# EAGLE schematic Flight-Mill-Controller (EAGLE 9.6.2)

## Sheet 1 of 5
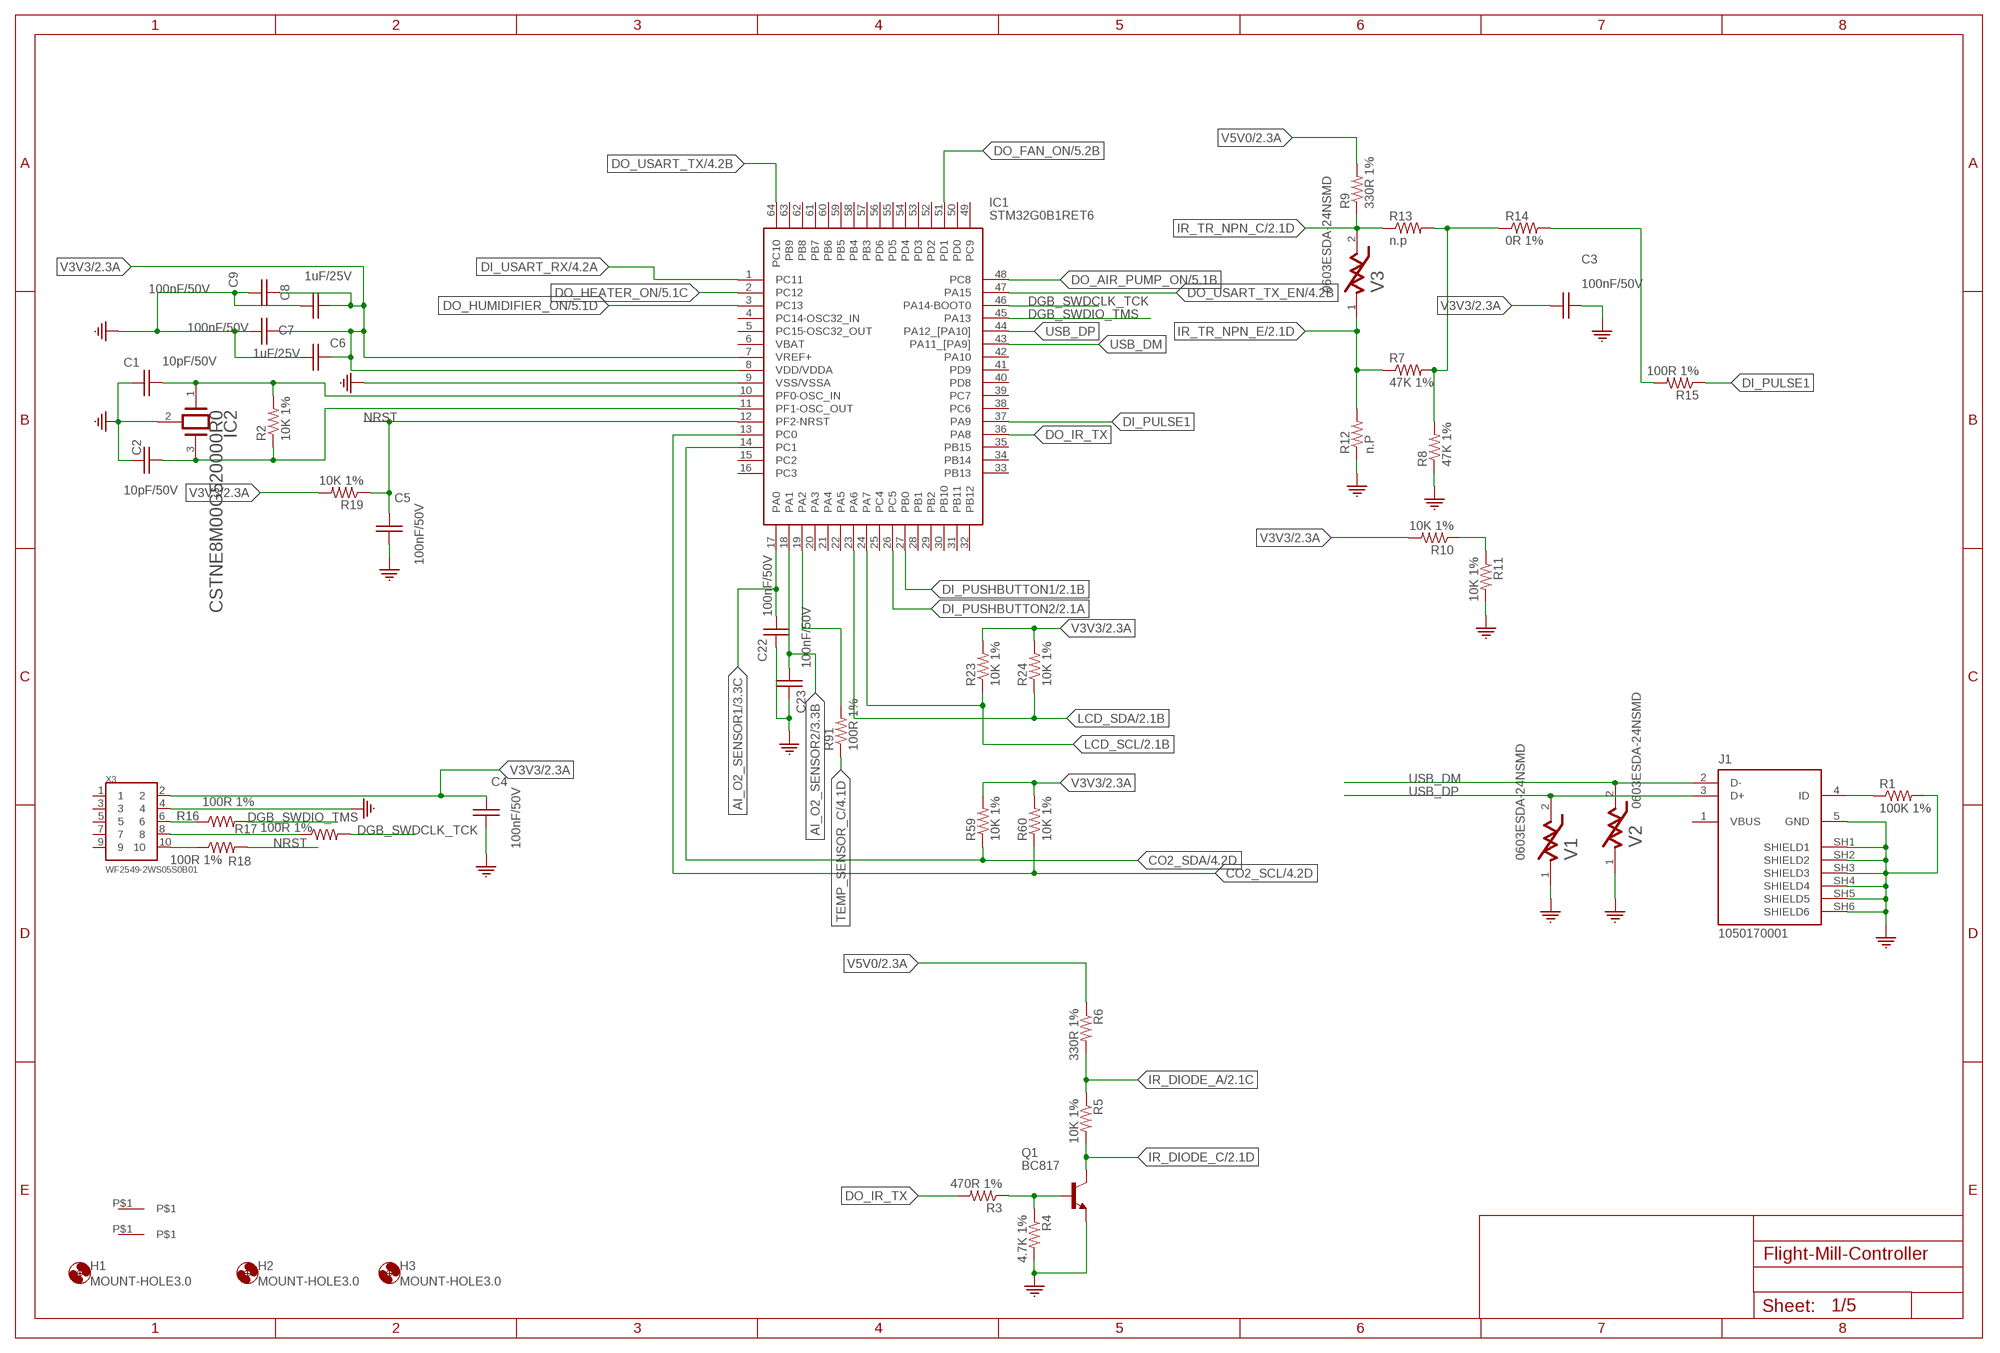
[diagram p0: schematic, sheet 1]

### Parts
C1  10pF/50V  C_0603EIA0603  [EIA0603]
C2  10pF/50V  C_0603EIA0603  [EIA0603]
C3  100nF/50V  C_0603EIA0603  [EIA0603]
C4  100nF/50V  C_0603EIA0603  [EIA0603]
C5  100nF/50V  C_0603EIA0603  [EIA0603]
C6  1uF/25V  C_0603EIA0603  [EIA0603]
C7  100nF/50V  C_0603EIA0603  [EIA0603]
C8  1uF/25V  C_0603EIA0603  [EIA0603]
C9  100nF/50V  C_0603EIA0603  [EIA0603]
C22  100nF/50V  C_0603EIA0603  [EIA0603]
C23  100nF/50V  C_0603EIA0603  [EIA0603]
FID1  FIDUCIAL  [FIDUCIAL]
FID2  FIDUCIAL  [FIDUCIAL]
H1  MOUNT-HOLE3.0  [3,0]
H2  MOUNT-HOLE3.0  [3,0]
H3  MOUNT-HOLE3.0  [3,0]
IC1  STM32G0B1RET6  [QFP50P1200X1200X160-64N]
IC2  CSTNE8M00G520000R0  [CSTNE8M00G520000R0]
J1  1050170001  [MOLEX_1050170001]
Q1  BC817  [SOT23]
R1  100K 1%  R_0603  [EIA0603]
R2  10K 1%  R_0603  [EIA0603]
R3  470R 1%  R_0603  [EIA0603]
R4  4.7K 1%  R_0603  [EIA0603]
R5  10K 1%  R_0603  [EIA0603]
R6  330R 1%  R_0603  [EIA0603]
R7  47K 1%  R_0603  [EIA0603]
R8  47K 1%  R_0603  [EIA0603]
R9  330R 1%  R_0603  [EIA0603]
R10  10K 1%  R_0603  [EIA0603]
R11  10K 1%  R_0603  [EIA0603]
R12  n.P  R_0603  [EIA0603]
R13  n.p  R_0603  [EIA0603]
R14  0R 1%  R_0603  [EIA0603]
R15  100R 1%  R_0603  [EIA0603]
R16  100R 1%  R_0603  [EIA0603]
R17  100R 1%  R_0603  [EIA0603]
R18  100R 1%  R_0603  [EIA0603]
R19  10K 1%  R_0603  [EIA0603]
R23  10K 1%  R_0603  [EIA0603]
R24  10K 1%  R_0603  [EIA0603]
R59  10K 1%  R_0603  [EIA0603]
R60  10K 1%  R_0603  [EIA0603]
R91  100R 1%  R_0603  [EIA0603]
V1  0603ESDA-24NSMD  [EIA0603]
V2  0603ESDA-24NSMD  [EIA0603]
V3  0603ESDA-24NSMD  [EIA0603]
X3  WF2549-2WS05S0B01  [X10_100MIL_2XROW_VERT]

### Nets
AI_O2_SENSOR1: C22.2 IC1.17(PA0) ; also sheet 3
AI_O2_SENSOR2: C23.2 IC1.18(PA1) ; also sheet 3
CO2_SCL: IC1.13(PC0) R60.1 ; also sheet 4
CO2_SDA: IC1.14(PC1) R59.1 ; also sheet 4
DGB_SWDCLK_TCK: IC1.46(PA14-BOOT0) R17.2
DGB_SWDIO_TMS: IC1.45(PA13) R16.2
DI_PULSE1: IC1.37(PA9) R15.1
DI_PUSHBUTTON1: IC1.27(PB0) ; also sheet 2
DI_PUSHBUTTON2: IC1.26(PC5) ; also sheet 2
DI_USART_RX: IC1.1(PC11) ; also sheet 4
DO_AIR_PUMP_ON [LV]: IC1.48(PC8) ; also sheet 5
DO_FAN_ON: IC1.51(PD1) ; also sheet 5
DO_HEATER_ON: IC1.2(PC12) ; also sheet 5
DO_HUMIDIFIER_ON: IC1.3(PC13) ; also sheet 5
DO_IR_TX: IC1.36(PA8) R3.2
DO_USART_TX: IC1.64(PC10) ; also sheet 4
DO_USART_TX_EN: IC1.47(PA15) ; also sheet 4
GND [LV]: C1.1 C2.1 C3.2 C4.1 C5.1 C6.2 C7.2 C8.2 C9.2 C22.1 C23.1 IC1.9(VSS/VSSA) IC2.2(GND) J1.5(GND) J1.SH1(SHIELD1) J1.SH2(SHIELD2) J1.SH3(SHIELD3) J1.SH4(SHIELD4) J1.SH5(SHIELD5) J1.SH6(SHIELD6) Q1.2(E) R1.2 R4.2 R8.1 R11.2 R12.1 V1.1 V2.1 X3.4 ; also sheet 2,3,4,5
IR_DIODE_A: R5.1 R6.2 ; also sheet 2
IR_DIODE_C: Q1.3(C) R5.2 ; also sheet 2
IR_TR_NPN_C: R9.1 R13.1 V3.2 ; also sheet 2
IR_TR_NPN_E: R7.1 R12.2 V3.1 ; also sheet 2
LCD_SCL: IC1.24(PA7) R23.1 ; also sheet 2
LCD_SDA: IC1.23(PA6) R24.1 ; also sheet 2
N$1: R16.1 X3.6
N$3: C1.2 IC1.10(PF0-OSC_IN) IC2.1(INPUT) R2.2
N$4: J1.4(ID) R1.1
N$5: C2.2 IC1.11(PF1-OSC_OUT) IC2.3(OUTPUT) R2.1
N$6: R7.2 R8.2 R13.2 R14.1
N$7: Q1.1(B) R3.1 R4.1
N$8: R10.1 R11.1
N$10: R14.2 R15.2
N$11: R17.1 X3.8
N$13: R18.1 X3.10
N$55: IC1.19(PA2) R91.2
NRST: C5.2 IC1.12(PF2-NRST) R18.2 R19.1
TEMP_SENSOR_C: R91.1 ; also sheet 4
USB_DM: IC1.43(PA11_[PA9]) J1.2(D-) V2.2
USB_DP: IC1.44(PA12_[PA10]) J1.3(D+) V1.2
V3V3: C3.1 C4.2 C6.1 C7.1 C8.1 C9.1 IC1.7(VREF+) IC1.8(VDD/VDDA) R10.2 R19.2 R23.2 R24.2 R59.2 R60.2 X3.2 ; also sheet 2,4
V5V0: R6.1 R9.2 ; also sheet 2,3,4
Unconnected: FID1.P$1 FID2.P$1 IC1.4(PC14-OSC32_IN) IC1.5(PC15-OSC32_OUT) IC1.6(VBAT) IC1.15(PC2) IC1.16(PC3) IC1.20(PA3) IC1.21(PA4) IC1.22(PA5) IC1.25(PC4) IC1.28(PB1) IC1.29(PB2) IC1.30(PB10) IC1.31(PB11) IC1.32(PB12) IC1.33(PB13) IC1.34(PB14) IC1.35(PB15) IC1.38(PC6) IC1.39(PC7) IC1.40(PD8) IC1.41(PD9) IC1.42(PA10) IC1.49(PC9) IC1.50(PD0) IC1.52(PD2) IC1.53(PD3) IC1.54(PD4) IC1.55(PD5) IC1.56(PD6) IC1.57(PB3) IC1.58(PB4) IC1.59(PB5) IC1.60(PB6) IC1.61(PB7) IC1.62(PB8) IC1.63(PB9) X3.1 X3.3 X3.5 X3.7 X3.9

## Sheet 2 of 5
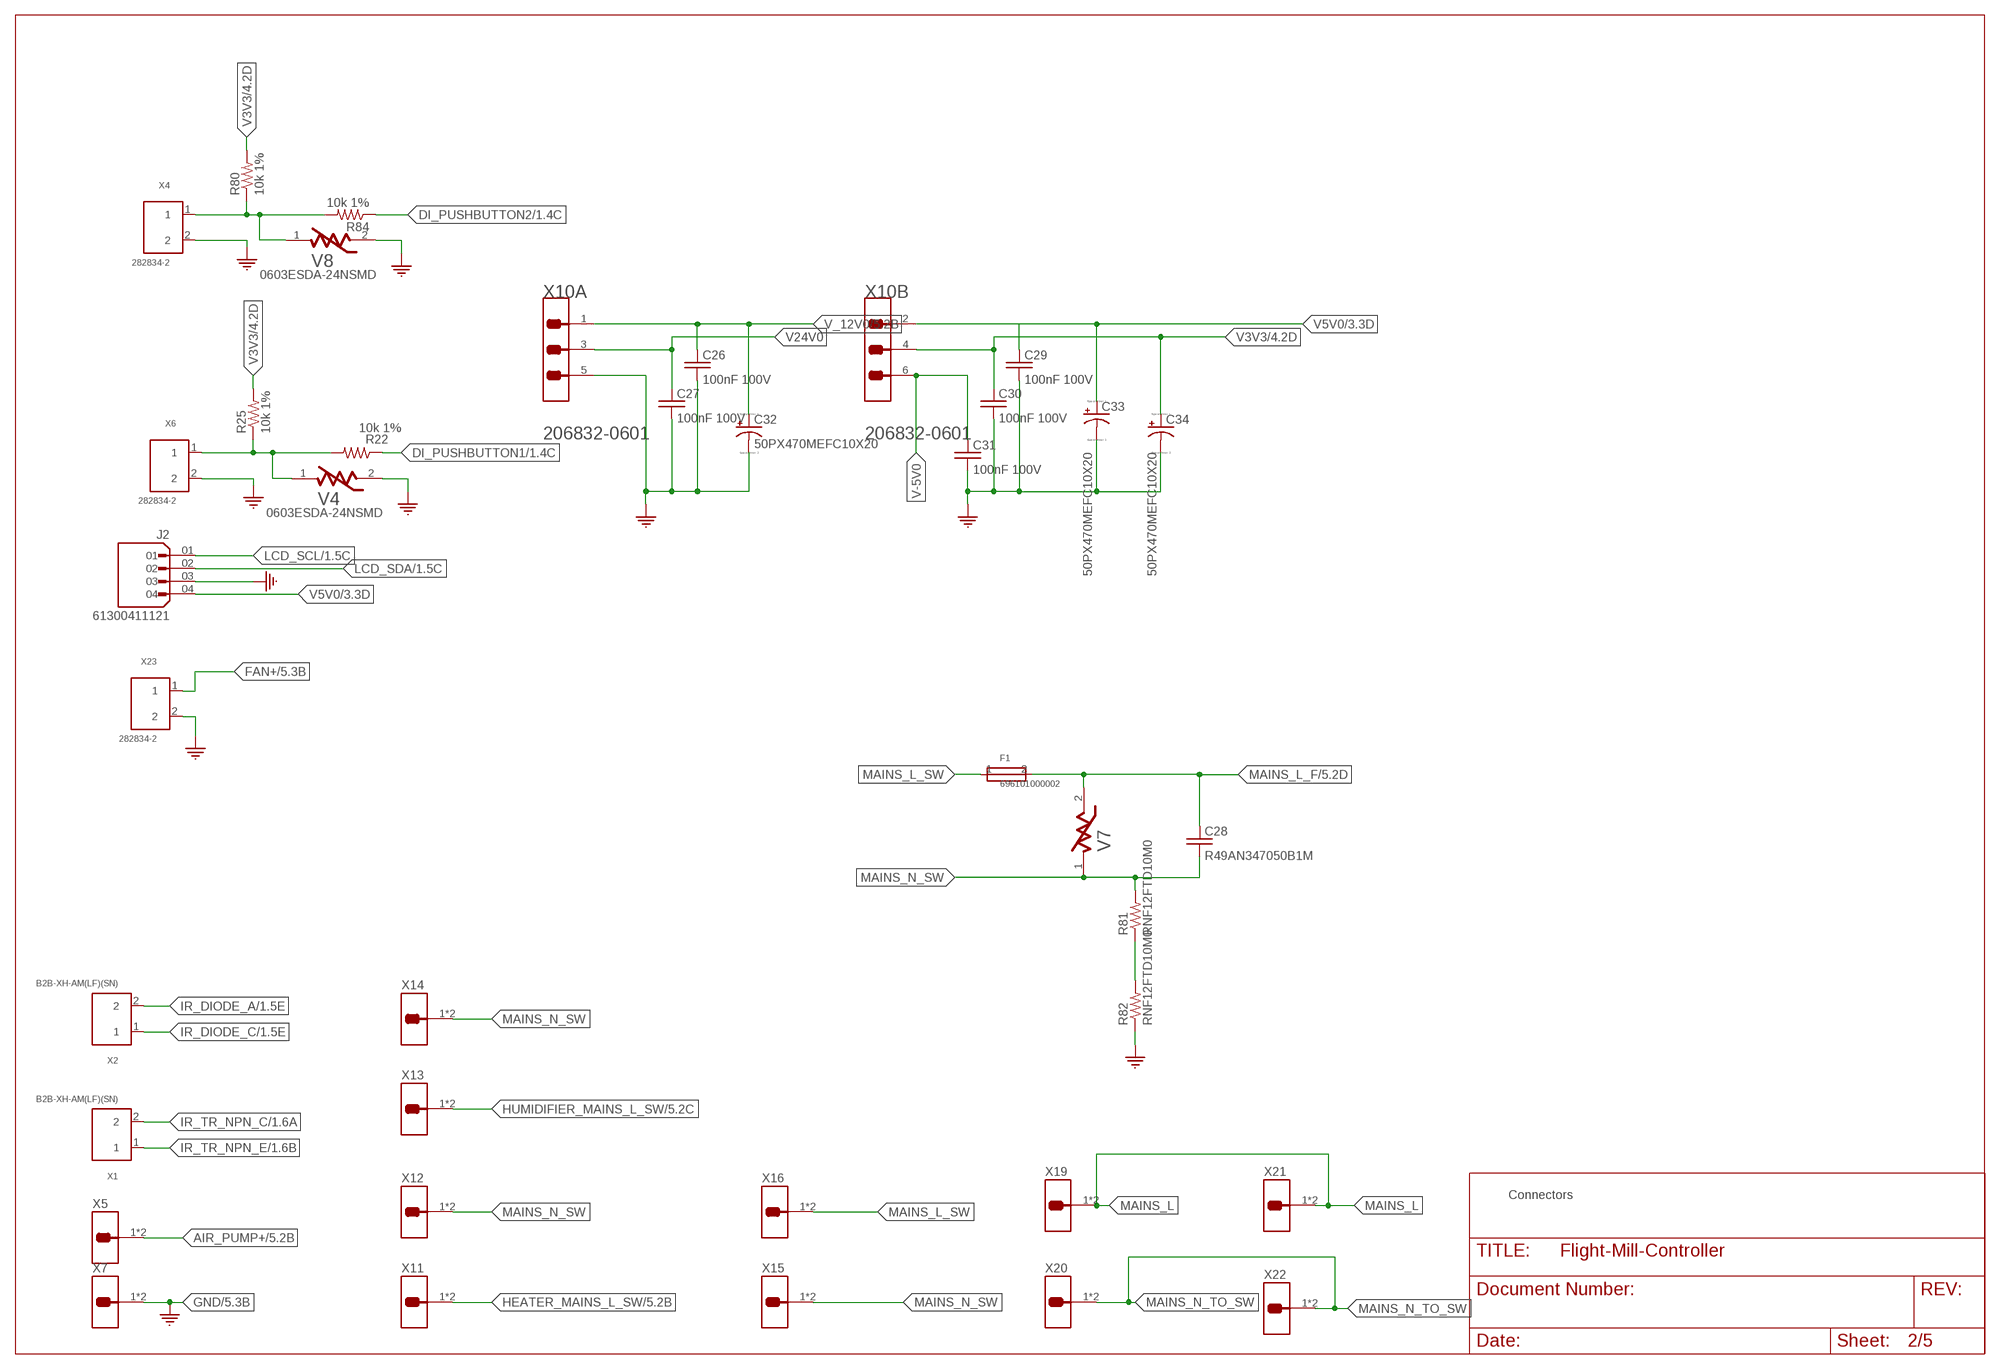
[diagram p1: schematic, sheet 2]
FRAME2 (DINA3_L): SHEETNAME: Connectors

### Parts
C26  100nF 100V  C_0603EIA0603  [EIA0603]
C27  100nF 100V  C_0603EIA0603  [EIA0603]
C28  R49AN347050B1M  [R49AN347050B1M]
C29  100nF 100V  C_0603EIA0603  [EIA0603]
C30  100nF 100V  C_0603EIA0603  [EIA0603]
C31  100nF 100V  C_0603EIA0603  [EIA0603]
C32  50PX470MEFC10X20  [CAPACITOR-ELKO-RM5-10X16]
C33  50PX470MEFC10X20  [CAPACITOR-ELKO-RM5-10X16]
C34  50PX470MEFC10X20  [CAPACITOR-ELKO-RM5-10X16]
F1  696101000002  [FUSE_RM22.6]
J2  61300411121  [X04_100MIL_1ROW]
R22  10k 1%  R_0603  [EIA0603]
R25  10k 1%  R_0603  [EIA0603]
R80  10k 1%  R_0603  [EIA0603]
R81  RNF12FTD10M0  [RES-RM12.5-VR37]
R82  RNF12FTD10M0  [RES-RM12.5-VR37]
R84  10k 1%  R_0603  [EIA0603]
V4  0603ESDA-24NSMD  [EIA0603]
V7  B72205S0271K101B72205S2131K101  [EPCOS_B72205S0271K101_0]
V8  0603ESDA-24NSMD  [EIA0603]
X1  B2B-XH-AM(LF)(SN)  [B2B-XH-AM(LF)(SN)]
X2  B2B-XH-AM(LF)(SN)  [B2B-XH-AM(LF)(SN)]
X4  282834-2  [TE_282834-2_0]
X5  726386-2TE_726386-2  [TE_726386-2]
X6  282834-2  [TE_282834-2_0]
X7  726386-2TE_726386-2  [TE_726386-2]
X10  MOLEX_206832-0601MOLEX_206832-0601  [MOLEX_206832-0601]
X11  726386-2TE_726386-2  [TE_726386-2]
X12  726386-2TE_726386-2  [TE_726386-2]
X13  726386-2TE_726386-2  [TE_726386-2]
X14  726386-2TE_726386-2  [TE_726386-2]
X15  726386-2TE_726386-2  [TE_726386-2]
X16  726386-2TE_726386-2  [TE_726386-2]
X19  726386-2TE_726386-2  [TE_726386-2]
X20  726386-2TE_726386-2  [TE_726386-2]
X21  726386-2TE_726386-2  [TE_726386-2]
X22  726386-2TE_726386-2  [TE_726386-2]
X23  282834-2  [TE_282834-2_0]

### Nets
AIR_PUMP+ [LV]: X5.1 X5.1-2 ; also sheet 5
DI_PUSHBUTTON1: R22.1 ; also sheet 1
DI_PUSHBUTTON2: R84.1 ; also sheet 1
FAN+: X23.1 ; also sheet 5
GND [LV]: C26.2 C27.2 C29.2 C30.2 C31.2 C32.2(-) C33.2(-) C34.2(-) J2.03 R82.1 V4.2 V8.2 X4.2 X6.2 X7.1 X7.1-2 X10.5 X23.2 ; also sheet 1,3,4,5
HEATER_MAINS_L_SW [Mains_L]: X11.1 X11.1-2 ; also sheet 5
HUMIDIFIER_MAINS_L_SW [Mains_L]: X13.1 X13.1-2 ; also sheet 5
IR_DIODE_A: X2.2 ; also sheet 1
IR_DIODE_C: X2.1 ; also sheet 1
IR_TR_NPN_C: X1.2 ; also sheet 1
IR_TR_NPN_E: X1.1 ; also sheet 1
LCD_SCL: J2.01 ; also sheet 1
LCD_SDA: J2.02 ; also sheet 1
MAINS_L [Mains_L]: X19.1 X19.1-2 X21.1 X21.1-2
MAINS_L_F [Mains_L]: C28.1 F1.2 V7.2 ; also sheet 5
MAINS_L_SW [Mains_L]: F1.1 X16.1 X16.1-2
MAINS_N_SW [Mains_N]: C28.2 R81.2 V7.1 X12.1 X12.1-2 X14.1 X14.1-2 X15.1 X15.1-2
MAINS_N_TO_SW [Mains_N]: X20.1 X20.1-2 X22.1 X22.1-2
N$47: R81.1 R82.2
N$50: R22.2 R25.1 V4.1 X6.1
N$51: R80.1 R84.2 V8.1 X4.1
V3V3: C30.1 C34.1(+) R25.2 R80.2 X10.4 ; also sheet 1,4
V5V0: C29.1 C33.1(+) J2.04 X10.2 ; also sheet 1,3,4
V24V0: C27.1 X10.3
V-5V0: C31.1 X10.6
V_12V0 [LV]: C26.1 C32.1(+) X10.1 ; also sheet 5

## Sheet 3 of 5
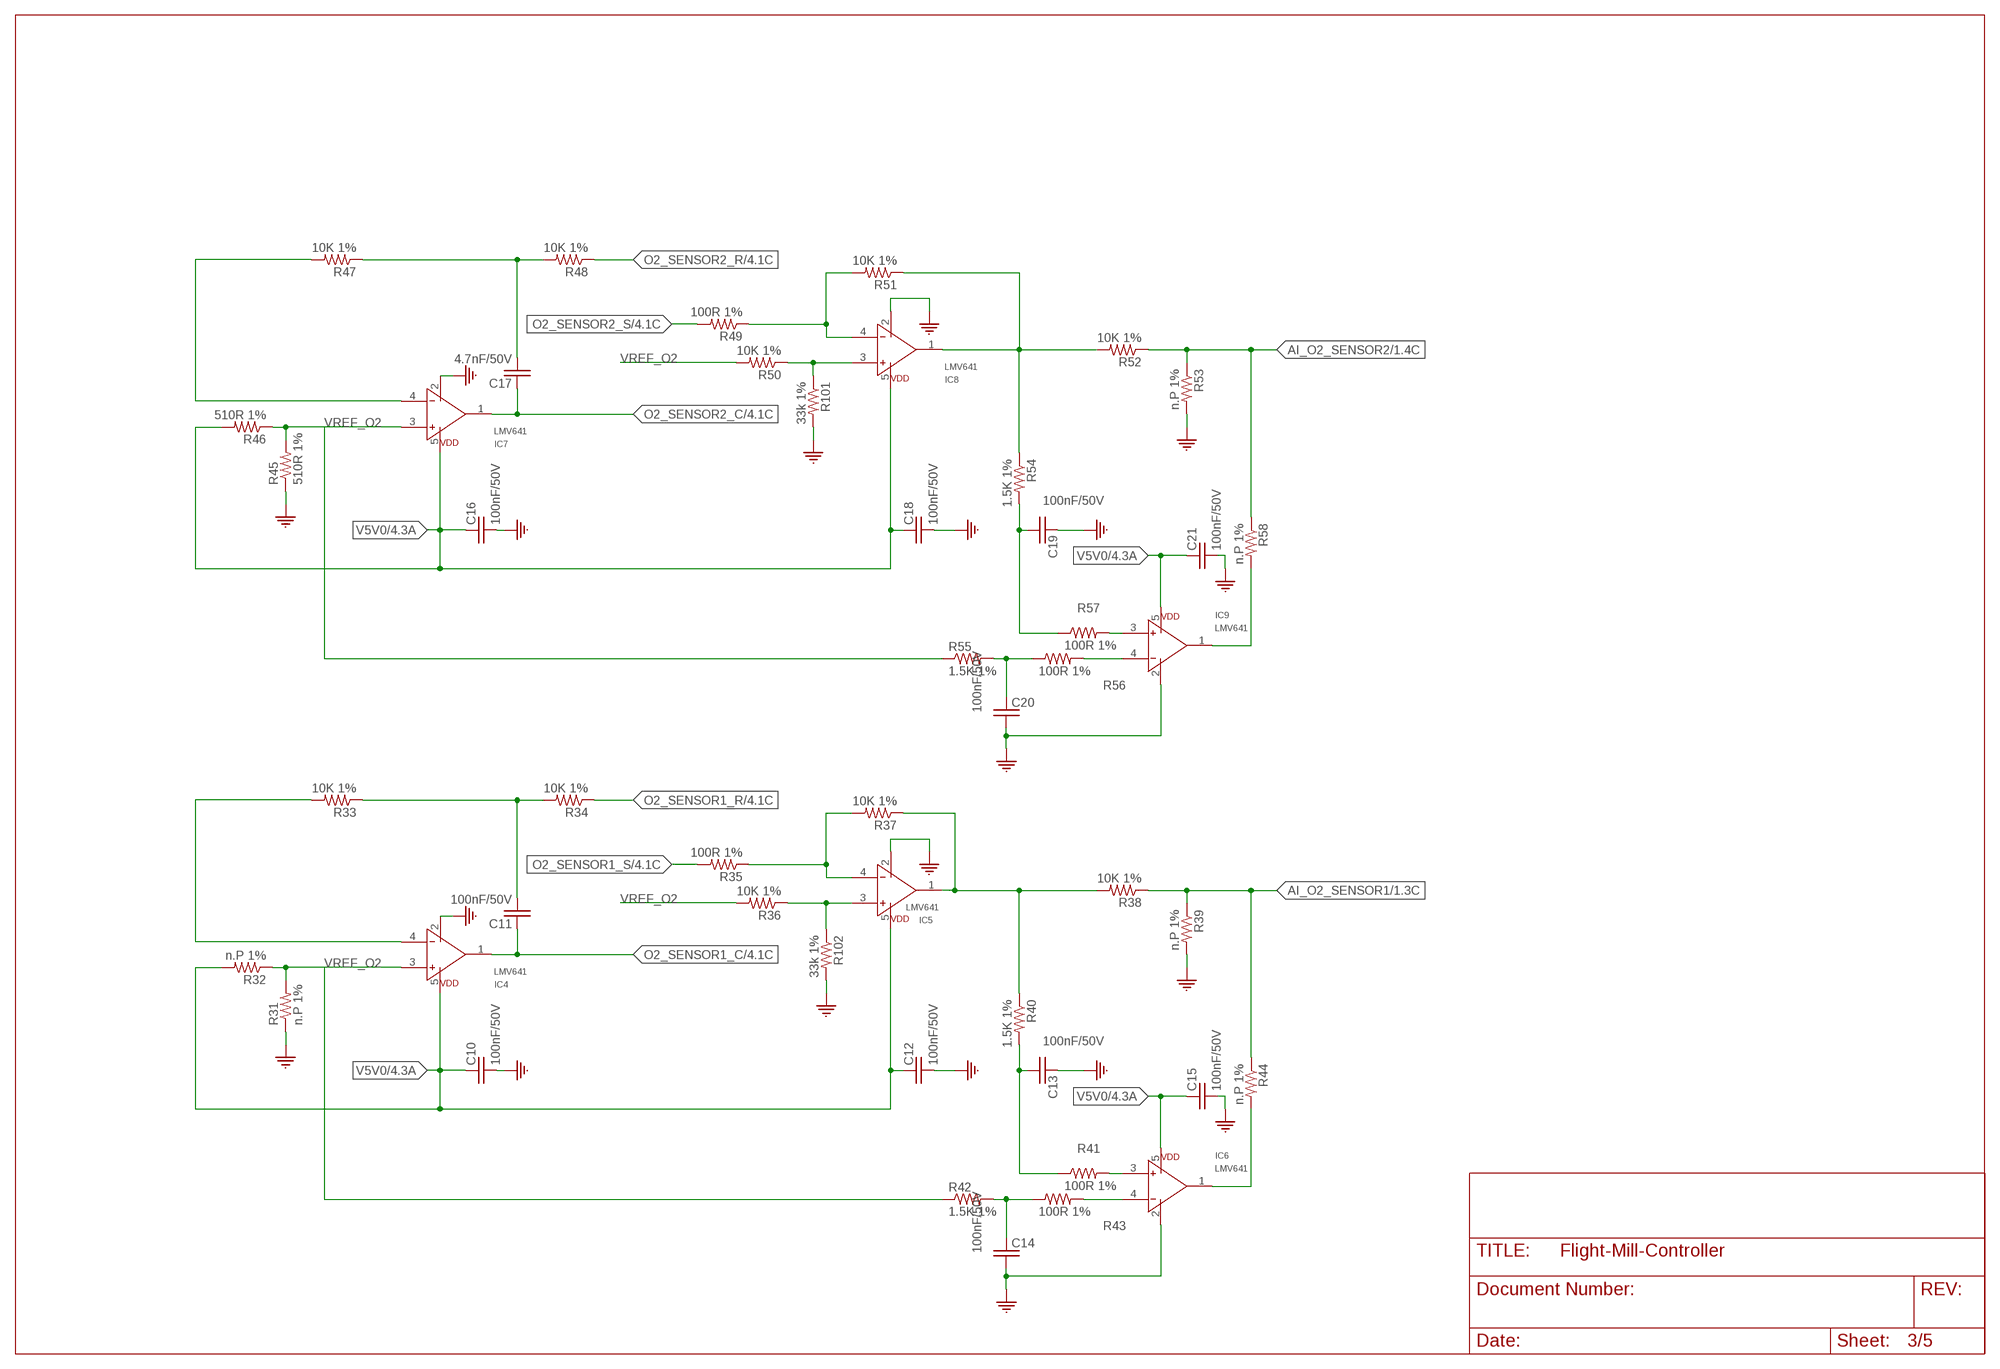
[diagram p2: schematic, sheet 3]

### Parts
C10  100nF/50V  C_0603EIA0603  [EIA0603]
C11  100nF/50V  C_0603EIA0603  [EIA0603]
C12  100nF/50V  C_0603EIA0603  [EIA0603]
C13  100nF/50V  C_0603EIA0603  [EIA0603]
C14  100nF/50V  C_0603EIA0603  [EIA0603]
C15  100nF/50V  C_0603EIA0603  [EIA0603]
C16  100nF/50V  C_0603EIA0603  [EIA0603]
C17  4.7nF/50V  C_0603EIA0603  [EIA0603]
C18  100nF/50V  C_0603EIA0603  [EIA0603]
C19  100nF/50V  C_0603EIA0603  [EIA0603]
C20  100nF/50V  C_0603EIA0603  [EIA0603]
C21  100nF/50V  C_0603EIA0603  [EIA0603]
IC4  LMV641  [SOT-23-5]
IC5  LMV641  [SOT-23-5]
IC6  LMV641  [SOT-23-5]
IC7  LMV641  [SOT-23-5]
IC8  LMV641  [SOT-23-5]
IC9  LMV641  [SOT-23-5]
R31  n.P 1%  R_0603  [EIA0603]
R32  n.P 1%  R_0603  [EIA0603]
R33  10K 1%  R_0603  [EIA0603]
R34  10K 1%  R_0603  [EIA0603]
R35  100R 1%  R_0603  [EIA0603]
R36  10K 1%  R_0603  [EIA0603]
R37  10K 1%  R_0603  [EIA0603]
R38  10K 1%  R_0603  [EIA0603]
R39  n.P 1%  R_0603  [EIA0603]
R40  1.5K 1%  R_0603  [EIA0603]
R41  100R 1%  R_0603  [EIA0603]
R42  1.5K 1%  R_0603  [EIA0603]
R43  100R 1%  R_0603  [EIA0603]
R44  n.P 1%  R_0603  [EIA0603]
R45  510R 1%  R_0603  [EIA0603]
R46  510R 1%  R_0603  [EIA0603]
R47  10K 1%  R_0603  [EIA0603]
R48  10K 1%  R_0603  [EIA0603]
R49  100R 1%  R_0603  [EIA0603]
R50  10K 1%  R_0603  [EIA0603]
R51  10K 1%  R_0603  [EIA0603]
R52  10K 1%  R_0603  [EIA0603]
R53  n.P 1%  R_0603  [EIA0603]
R54  1.5K 1%  R_0603  [EIA0603]
R55  1.5K 1%  R_0603  [EIA0603]
R56  100R 1%  R_0603  [EIA0603]
R57  100R 1%  R_0603  [EIA0603]
R58  n.P 1%  R_0603  [EIA0603]
R101  33k 1%  R_0603  [EIA0603]
R102  33k 1%  R_0603  [EIA0603]

### Nets
AI_O2_SENSOR: IC5.1(OUT) R37.1 R38.2 R40.1
AI_O2_SENSOR1: R38.1 R39.1 R44.1 ; also sheet 1
AI_O2_SENSOR2: R52.1 R53.1 R58.1 ; also sheet 1
GND [LV]: C10.2 C12.2 C13.1 C14.2 C15.2 C16.2 C18.2 C19.1 C20.2 C21.2 IC4.2(VEE) IC5.2(VEE) IC6.2(VEE) IC7.2(VEE) IC8.2(VEE) IC9.2(VEE) R31.1 R39.2 R45.1 R53.2 R101.2 R102.2 ; also sheet 1,2,4,5
N$14: IC5.4(IN-) R35.1 R37.2
N$15: C13.2 R40.2 R41.1
N$16: C11.2 R33.1 R34.2
N$17: IC4.4(IN-) R33.2
N$18: IC6.3(IN+) R41.2
N$19: IC5.3(IN+) R36.1 R102.1
N$20: IC6.4(IN-) R43.2
N$21: C14.1 R42.2 R43.1
N$22: IC6.1(OUT) R44.2
N$23: C17.2 R47.1 R48.2
N$24: IC7.4(IN-) R47.2
N$25: IC8.4(IN-) R49.1 R51.2
N$26: IC8.3(IN+) R50.1 R101.1
N$27: C19.2 R54.2 R57.1
N$28: IC9.3(IN+) R57.2
N$29: IC9.4(IN-) R56.2
N$30: C20.1 R55.2 R56.1
N$31: IC9.1(OUT) R58.2
N$32: IC8.1(OUT) R51.1 R52.2 R54.1
O2_SENSOR1_C: C11.1 IC4.1(OUT) ; also sheet 4
O2_SENSOR1_R: R34.1 ; also sheet 4
O2_SENSOR1_S: R35.2 ; also sheet 4
O2_SENSOR2_C: C17.1 IC7.1(OUT) ; also sheet 4
O2_SENSOR2_R: R48.1 ; also sheet 4
O2_SENSOR2_S: R49.2 ; also sheet 4
V5V0: C10.1 C12.1 C15.1 C16.1 C18.1 C21.1 IC4.5(VCC) IC5.5(VCC) IC6.5(VCC) IC7.5(VCC) IC8.5(VCC) IC9.5(VCC) R32.2 R46.2 ; also sheet 1,2,4
VREF_O2: IC4.3(IN+) IC7.3(IN+) R31.2 R32.1 R36.2 R42.1 R45.2 R46.1 R50.2 R55.1

## Sheet 4 of 5
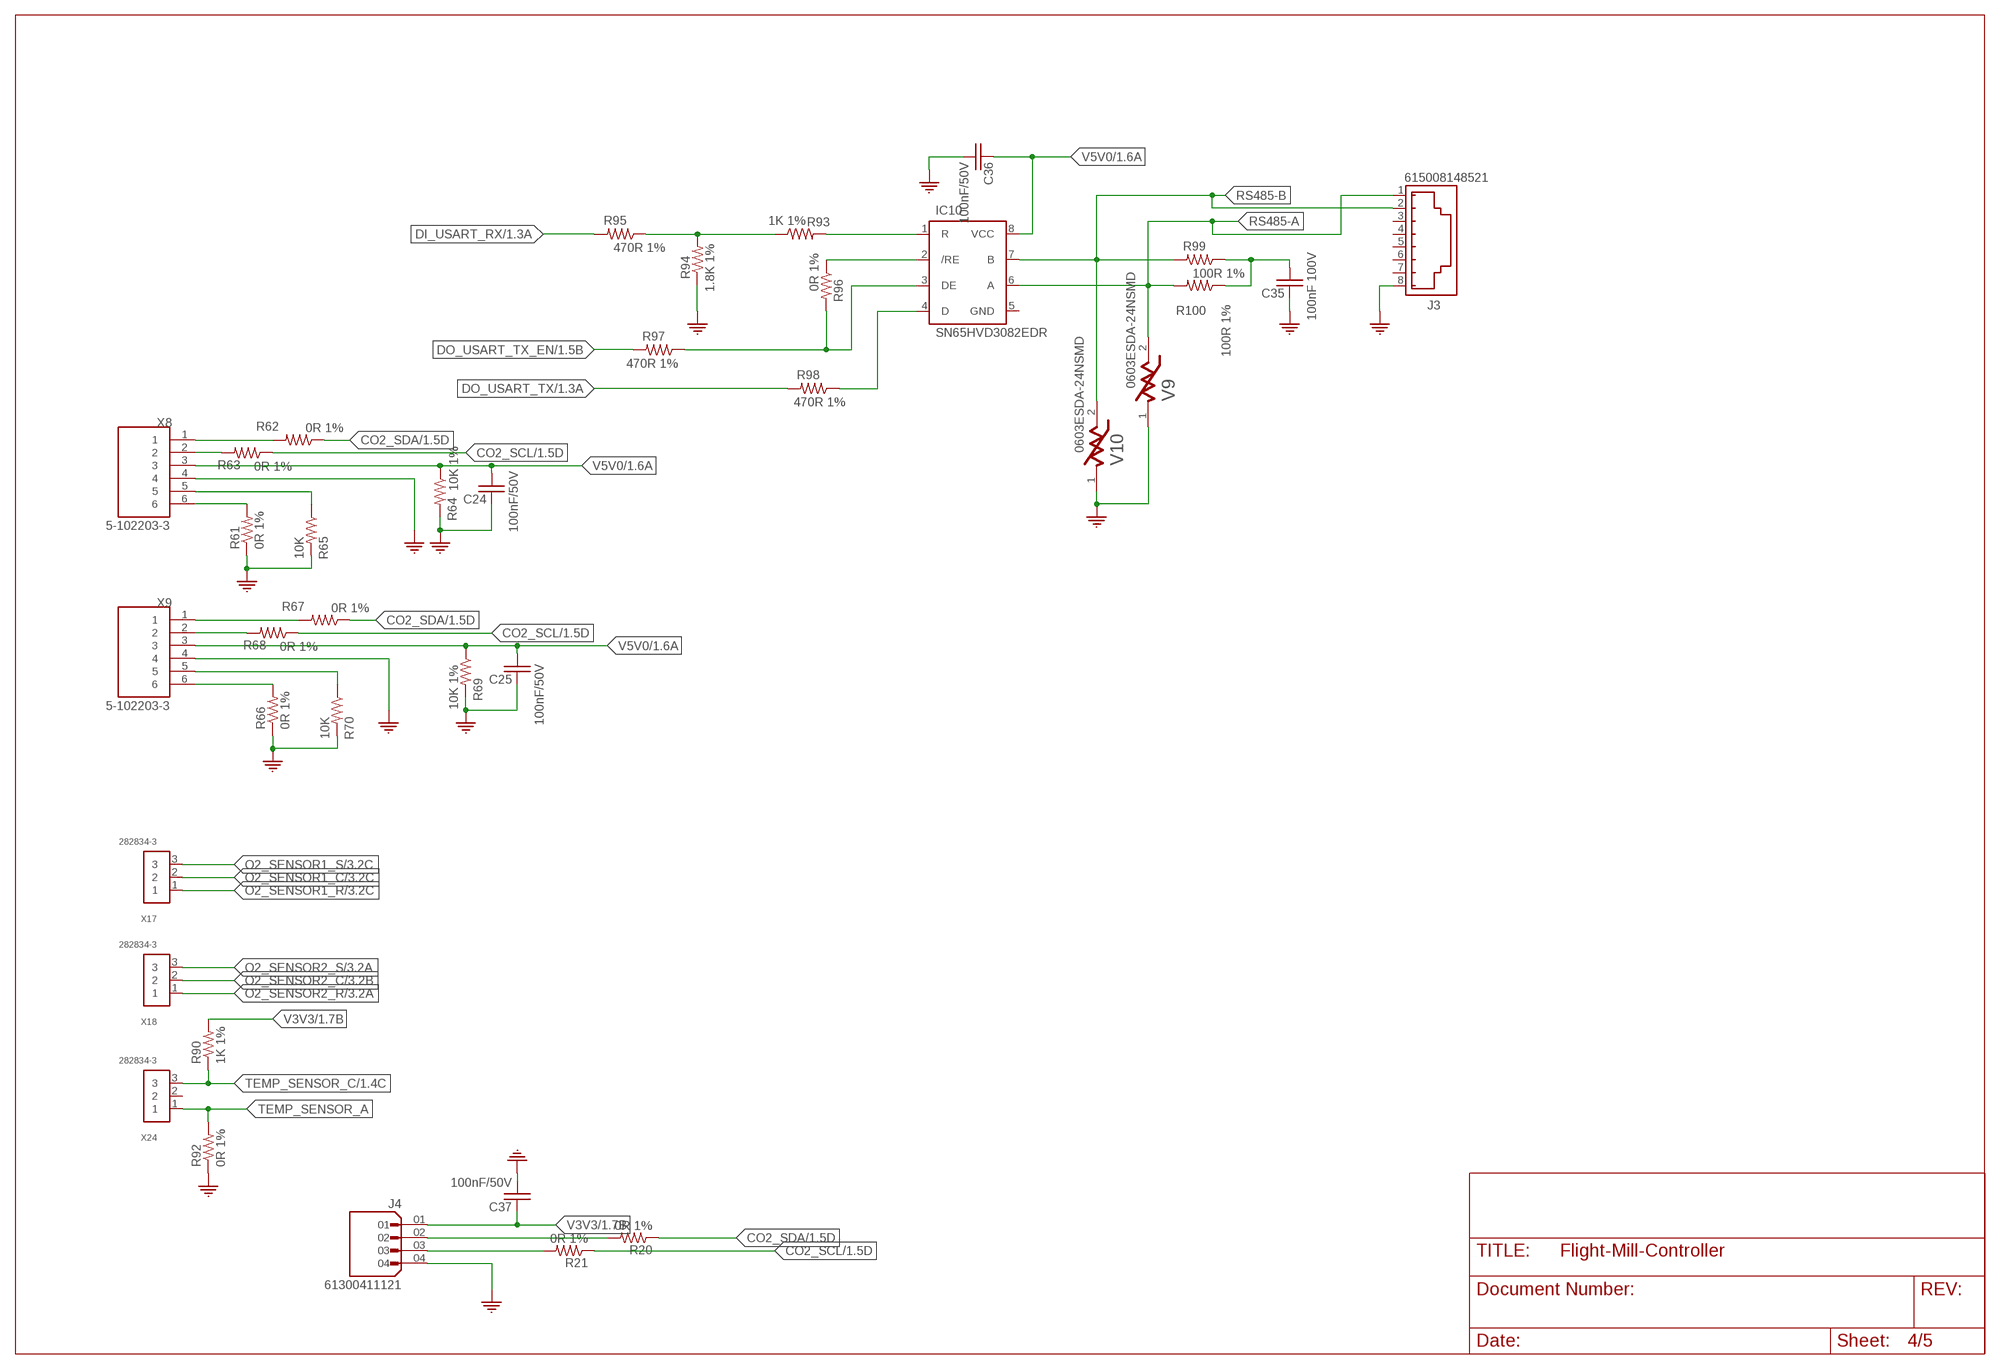
[diagram p3: schematic, sheet 4]

### Parts
C24  100nF/50V  C_0603EIA0603  [EIA0603]
C25  100nF/50V  C_0603EIA0603  [EIA0603]
C35  100nF 100V  C_0603EIA0603  [EIA0603]
C36  100nF/50V  C_0603EIA0603  [EIA0603]
C37  100nF/50V  C_0603EIA0603  [EIA0603]
IC10  SN65HVD3082EDR  [SOIC8]
J3  615008148521  [615008148521]
J4  61300411121  [X04_100MIL_1ROW]
R20  0R 1%  R_0603  [EIA0603]
R21  0R 1%  R_0603  [EIA0603]
R61  0R 1%  R_0603  [EIA0603]
R62  0R 1%  R_0603  [EIA0603]
R63  0R 1%  R_0603  [EIA0603]
R64  10K 1%  R_0603  [EIA0603]
R65  10K  R_0603  [EIA0603]
R66  0R 1%  R_0603  [EIA0603]
R67  0R 1%  R_0603  [EIA0603]
R68  0R 1%  R_0603  [EIA0603]
R69  10K 1%  R_0603  [EIA0603]
R70  10K  R_0603  [EIA0603]
R90  1K 1%  R_0603  [EIA0603]
R92  0R 1%  R_0603  [EIA0603]
R93  1K 1%  R_0603  [EIA0603]
R94  1.8K 1%  R_0603  [EIA0603]
R95  470R 1%  R_0603  [EIA0603]
R96  0R 1%  R_0603  [EIA0603]
R97  470R 1%  R_0603  [EIA0603]
R98  470R 1%  R_0603  [EIA0603]
R99  100R 1%  R_0603  [EIA0603]
R100  100R 1%  R_0603  [EIA0603]
V9  0603ESDA-24NSMD  [EIA0603]
V10  0603ESDA-24NSMD  [EIA0603]
X8  5-102203-3  [TE_5-102203-3]
X9  5-102203-3  [TE_5-102203-3]
X17  282834-3  [TE_282834-3_0]
X18  282834-3  [TE_282834-3_0]
X24  282834-3  [TE_282834-3_0]

### Nets
CO2_SCL: R21.1 R63.1 R68.1 ; also sheet 1
CO2_SDA: R20.1 R62.1 R67.1 ; also sheet 1
DI_USART_RX: R95.2 ; also sheet 1
DO_USART_TX: R98.2 ; also sheet 1
DO_USART_TX_EN: R97.2 ; also sheet 1
GND [LV]: C24.1 C25.1 C35.1 C36.2 C37.2 J3.8 J4.04 R61.1 R64.2 R65.2 R66.1 R69.2 R70.2 R92.1 R94.1 V9.1 V10.1 X8.4 X9.4 ; also sheet 1,2,3,5
N$33: R61.2 X8.6
N$34: R62.2 X8.1
N$35: R63.2 X8.2
N$36: R65.1 X8.5
N$37: R66.2 X9.6
N$38: R67.2 X9.1
N$39: R68.2 X9.2
N$40: R70.1 X9.5
N$56: R93.1 R94.2 R95.1
N$57: IC10.1(R) R93.2
N$59: IC10.2(/RE) R96.1
N$60: IC10.3(DE) R96.2 R97.1
N$61: IC10.4(D) R98.1
N$62: J4.02 R20.2
N$63: J4.03 R21.2
N$64: C35.2 R99.1 R100.1
O2_SENSOR1_C: X17.2 ; also sheet 3
O2_SENSOR1_R: X17.1 ; also sheet 3
O2_SENSOR1_S: X17.3 ; also sheet 3
O2_SENSOR2_C: X18.2 ; also sheet 3
O2_SENSOR2_R: X18.1 ; also sheet 3
O2_SENSOR2_S: X18.3 ; also sheet 3
RS485-A: IC10.6(A) J3.1 R100.2 V9.2
RS485-B: IC10.7(B) J3.2 R99.2 V10.2
TEMP_SENSOR_A: R92.2 X24.1
TEMP_SENSOR_C: R90.1 X24.3 ; also sheet 1
V3V3: C37.1 J4.01 R90.2 ; also sheet 1,2
V5V0: C24.2 C25.2 C36.1 IC10.8(VCC) R64.1 R69.1 X8.3 X9.3 ; also sheet 1,2,3
Unconnected: IC10.5(GND) J3.3 J3.4 J3.5 J3.6 J3.7 X24.2

## Sheet 5 of 5
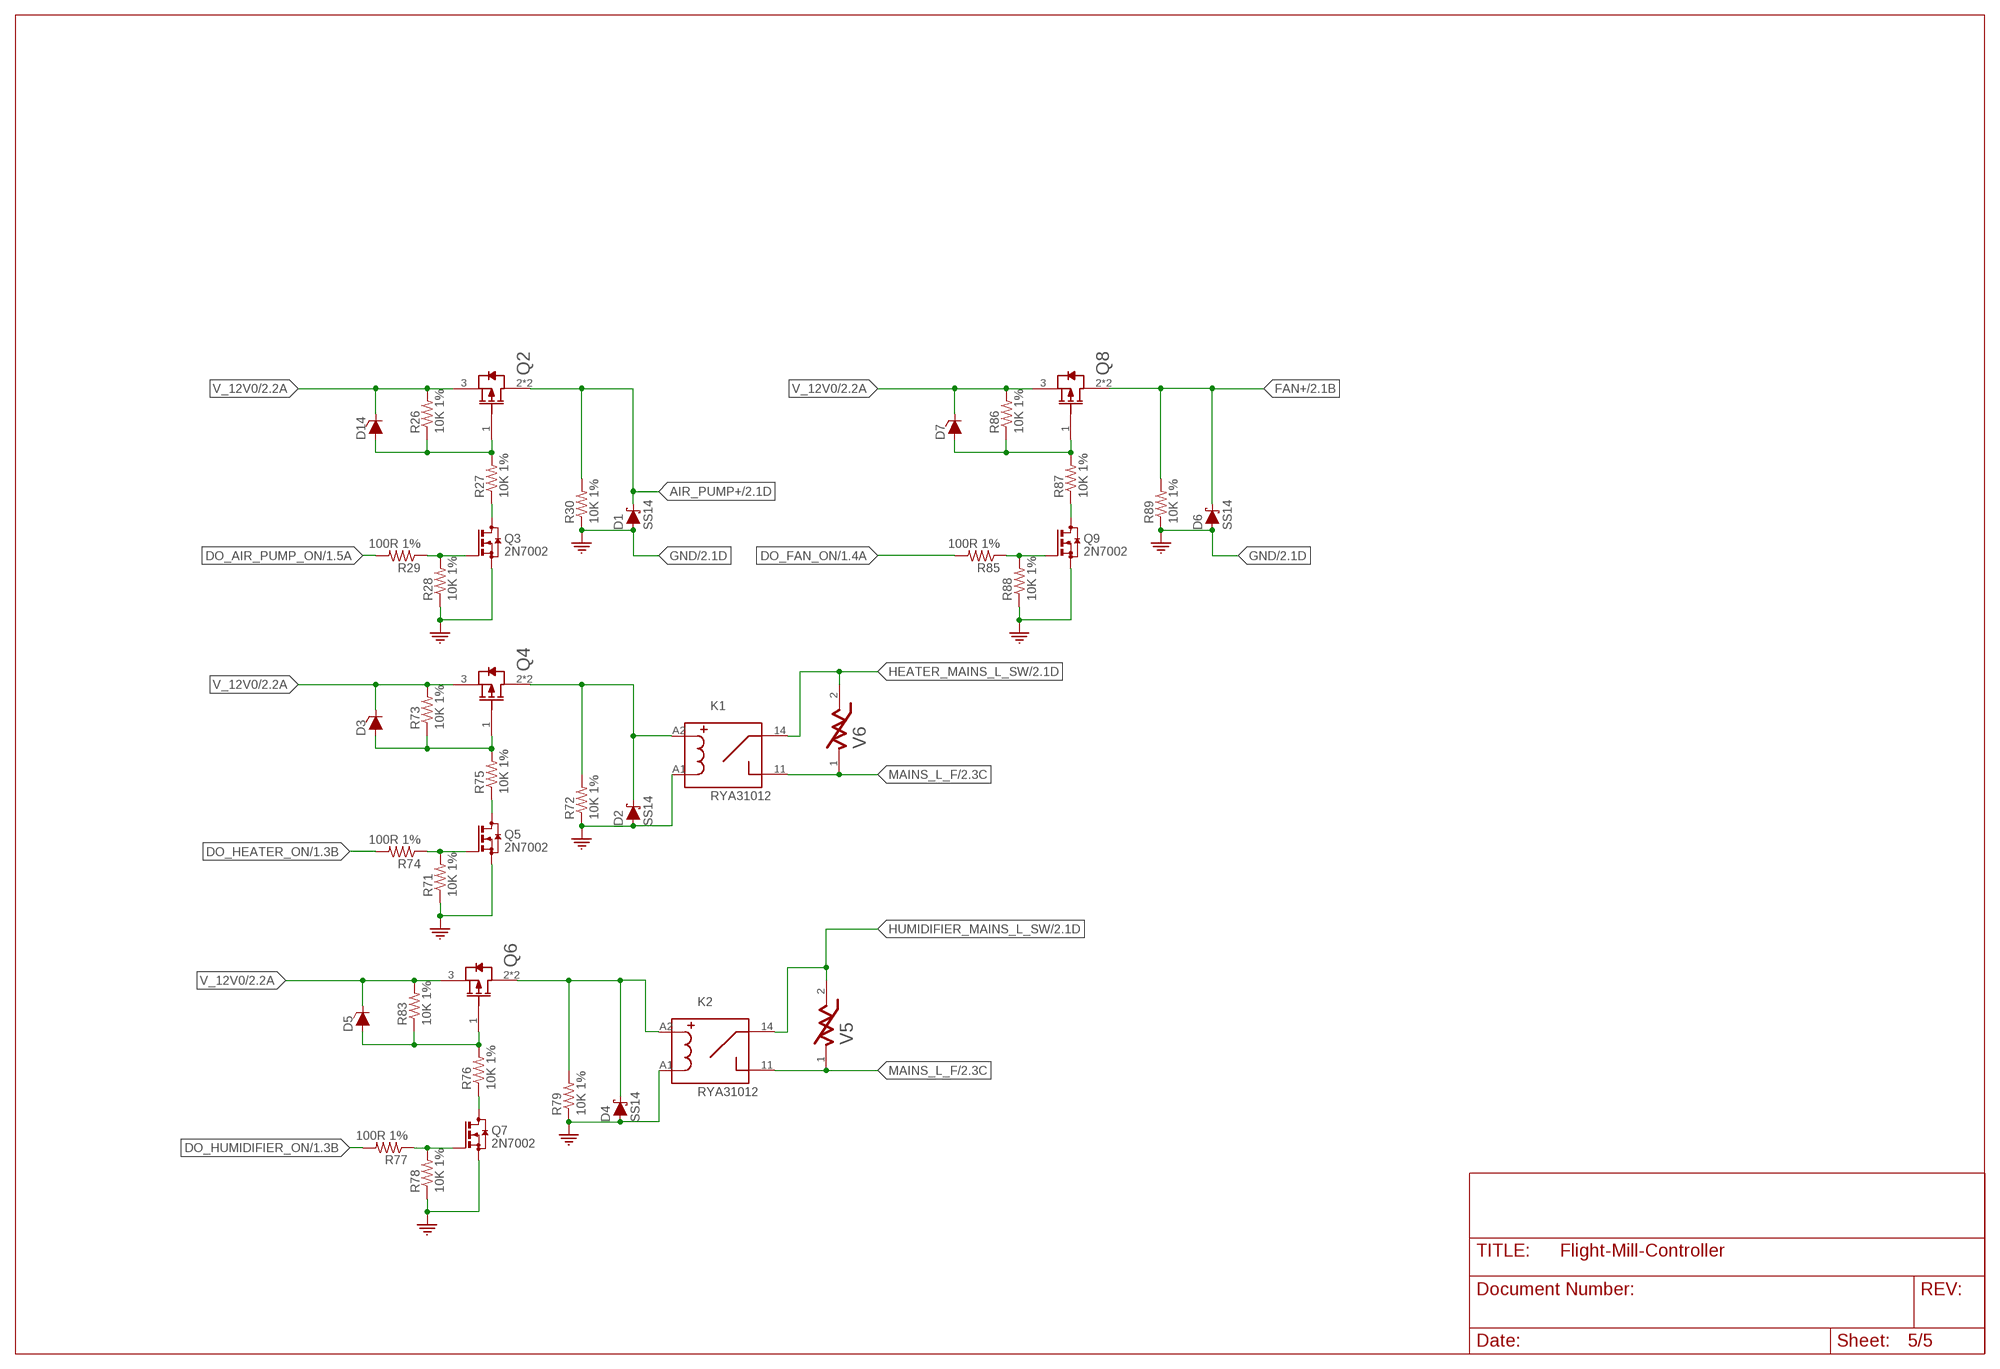
[diagram p4: schematic, sheet 5]

### Parts
D1  SS14  [SMA]
D2  SS14  [SMA]
D3  MMBZ4696-HE3-18  [SOT23-3]
D4  SS14  [SMA]
D5  MMBZ4696-HE3-18  [SOT23-3]
D6  SS14  [SMA]
D7  MMBZ4696-HE3-18  [SOT23-3]
D14  MMBZ4696-HE3-18  [SOT23-3]
K1  RYA31012  [RYA31012]
K2  RYA31012  [RYA31012]
Q2  UT2955G-AA3-R  [SOT223]
Q3  2N7002  [SOT23]
Q4  UT2955G-AA3-R  [SOT223]
Q5  2N7002  [SOT23]
Q6  UT2955G-AA3-R  [SOT223]
Q7  2N7002  [SOT23]
Q8  UT2955G-AA3-R  [SOT223]
Q9  2N7002  [SOT23]
R26  10K 1%  R_0603  [EIA0603]
R27  10K 1%  R_0603  [EIA0603]
R28  10K 1%  R_0603  [EIA0603]
R29  100R 1%  R_0603  [EIA0603]
R30  10K 1%  R_0603  [EIA0603]
R71  10K 1%  R_0603  [EIA0603]
R72  10K 1%  R_0603  [EIA0603]
R73  10K 1%  R_0603  [EIA0603]
R74  100R 1%  R_0603  [EIA0603]
R75  10K 1%  R_0603  [EIA0603]
R76  10K 1%  R_0603  [EIA0603]
R77  100R 1%  R_0603  [EIA0603]
R78  10K 1%  R_0603  [EIA0603]
R79  10K 1%  R_0603  [EIA0603]
R83  10K 1%  R_0603  [EIA0603]
R85  100R 1%  R_0603  [EIA0603]
R86  10K 1%  R_0603  [EIA0603]
R87  10K 1%  R_0603  [EIA0603]
R88  10K 1%  R_0603  [EIA0603]
R89  10K 1%  R_0603  [EIA0603]
V5  B72205S0271K101B72205S2131K101  [EPCOS_B72205S0271K101_0]
V6  B72205S0271K101B72205S2131K101  [EPCOS_B72205S0271K101_0]

### Nets
AIR_PUMP+ [LV]: D1.1(C) Q2.2(DRAIN) Q2.4(DRAIN) R30.2 ; also sheet 2
DO_AIR_PUMP_ON [LV]: R29.2 ; also sheet 1
DO_FAN_ON: R85.2 ; also sheet 1
DO_HEATER_ON: R74.2 ; also sheet 1
DO_HUMIDIFIER_ON: R77.2 ; also sheet 1
FAN+: D6.1(C) Q8.2(DRAIN) Q8.4(DRAIN) R89.2 ; also sheet 2
GND [LV]: D1.2(A) D2.2(A) D4.2(A) D6.2(A) K1.A1 K2.A1 Q3.2(S) Q5.2(S) Q7.2(S) Q9.2(S) R28.1 R30.1 R71.1 R72.1 R78.1 R79.1 R88.1 R89.1 ; also sheet 1,2,3,4
HEATER_MAINS_L_SW [Mains_L]: K1.14 V6.2 ; also sheet 2
HUMIDIFIER_MAINS_L_SW [Mains_L]: K2.14 V5.2 ; also sheet 2
MAINS_L_F [Mains_L]: K1.11 K2.11 V5.1 V6.1 ; also sheet 2
N$2 [LV]: D14.1(A) Q2.1(GATE) R26.1 R27.2
N$9 [LV]: Q3.3(D) R27.1
N$12 [LV]: Q3.1(G) R28.2 R29.1
N$41 [LV]: D3.1(A) Q4.1(GATE) R73.1 R75.2
N$42 [LV]: Q5.3(D) R75.1
N$43 [LV]: Q5.1(G) R71.2 R74.1
N$44 [LV]: D5.1(A) Q6.1(GATE) R76.2 R83.1
N$45 [LV]: Q7.3(D) R76.1
N$46 [LV]: Q7.1(G) R77.1 R78.2
N$48 [LV]: D4.1(C) K2.A2 Q6.2(DRAIN) Q6.4(DRAIN) R79.2
N$49 [LV]: D2.1(C) K1.A2 Q4.2(DRAIN) Q4.4(DRAIN) R72.2
N$52 [LV]: D7.1(A) Q8.1(GATE) R86.1 R87.2
N$53 [LV]: Q9.3(D) R87.1
N$54 [LV]: Q9.1(G) R85.1 R88.2
V_12V0 [LV]: D3.3(C) D5.3(C) D7.3(C) D14.3(C) Q2.3(SOURCE) Q4.3(SOURCE) Q6.3(SOURCE) Q8.3(SOURCE) R26.2 R73.2 R83.2 R86.2 ; also sheet 2

## Power pins joined to a net without a drawn wire
VBUS: J1.1(VBUS)

## Library data of the parts
C1-C27 C29-C31 C35-C37 = Labops_Lib_AH:C_0603
C28 = Labops_Lib_AH:R49AN347050B1M: 0.47µF X Cap 330V 800V Polypropylene (PP), Metallized Radial; DESCRIPTION: Film,X1,470nF/330Vac,THT; LIB_STATUS: Verified; MFN: R49AN347050B1M; MFR: Kemet; OUR_STOCK: 8; PART_VALUE: 470nF/330VAC; PRICE-1: 1.51; SUPPLIER-1: Digikey
C32-C34 = Labops_Lib_AH:50PX470MEFC10X20: Electrolytic Cap, 470µF, 25V, Low ESR, Kemet, Pitch=5mm, Dia=10mm, L=12,5mm; DESCRIPTION: 470uF ±20% 50V 10mm 20mm 5mm 2000Hrs @ 105℃ -55℃ ~ +105℃; LIB_STATUS: Prototype; MFN: 50PX470MEFC10X20; MFR: Rubicon; OUR_STOCK: 20; PART_VALUE: 470uF/50V; PRICE-1: 0.14; SUPPLIER-1: LCSC; TECHNOLOGY: THT
D1 D2 D4 D6 = Labops_Lib_AH:SS14; DESCRIPTION: Diode Schottky 1A/40V (SMA); LIB_STATUS: Prototype; MFN: SS14-LTP; MFR: MCC; OUR_STOCK: 10; PART_VALUE: Schottky 1A/40V; PRICE-1: 0.05; SUPPLIER-1: LCSC
D3 D5 D7 D14 = Labops_Lib_AH:MMBZ4696-HE3-18: Zener 9.1 Volt 0.225W 5%; DESCRIPTION: Zener Diodes 9.1 Volt 0.225W 5% AUTO; MFN: MMBZ4696-HE3-18; MFR: Vishay; OUR_STOCK: 500; PART_VALUE: 9V 5%; PRICE-1: 0.06; SUPPLIER-1: Mouser
F1 = Labops_Lib_AH:696101000002; DESCRIPTION: Fuse Block 10 A 250V 1 Circuit Cartridge Through Hole; LIB_STATUS: Prototype; MFN: 696101000002; MFR: Wurth Elektronik; OUR_STOCK: 10; PART_VALUE: 10A 5mmx20mm; PRICE-1: 0.64; SUPPLIER-1: Digikey
FID1 FID2 = Labops_Lib_AH:FIDUCIAL
H1-H3 = holes:MOUNT-HOLE: MOUNTING HOLE with drill center marker
IC1 = Labops_Lib_AH:STM32G0B1RET6: Mainstream Arm Cortex-M0+ 32-bit MCU, up to 512KB Flash, 144KB RAM, 6x USART, timers, ADC, DAC, comm. I/Fs, 1.7-3.6V Source: Datasheet <https://www.st.com/resource/en/datasheet/stm32g0b1cc.pdf>; ARROW_PART_NUMBER: STM32G0B1RET6; ARROW_PRICE-STOCK: https://www.arrow.com/en/products/stm32g0b1ret6/stmicroelectronics?region=nac; DESCRIPTION: Mainstream Arm Cortex-M0+ 32-bit MCU, up to 512KB Flash, 144KB RAM, 6x USART, timers, ADC, DAC, comm. I/Fs, 1.7-3.6V; HEIGHT: 1.6mm; MANUFACTURER_NAME: STMicroelectronics; MANUFACTURER_PART_NUMBER: STM32G0B1RET6; MOUSER_PART_NUMBER: 511-STM32G0B1RET6; MOUSER_PRICE-STOCK: https://www.mouser.co.uk/ProductDetail/STMicroelectronics/STM32G0B1RET6?qs=pUKx8fyJudDnJgtz7LZZ0A%3D%3D
IC2 = Labops_Lib_AH:CSTNE8M00G520000R0: 8.000MHz ±0.50% Ceramic Resonator with Built in Capacitor 10pF 40Ω Stability ±0.20% 3-SMD; DESCRIPTION: 8MHz ±0.5% 10pF 40Ω SMD3213-3P Ceramic Resonators; LIB_STATUS: Prototype; MFN: CSTNE8M00G520000R0; MFR: Murata; PART_VALUE: 8MHz, 0.5%; PRICE-1: 0.12; SUPPLIER-1: LCSC
IC4-IC9 = Labops_Lib_AH:LMV641: Opamp, 1MHz, SOT23-5, One Channel, Rail-Rail; DESCRIPTION: 1CH 10MHz 1 Low power 2.3 V/us 2.7V~12V SOT-23-5 OpAmp; MFN: LMV641MF/NOPB; MFR: Texas Instruments; PACKAGE: SOT23-5; PART_VALUE: LMV641
IC10 = Labops_Lib_AH:SN65HVD3082EDR; DESCRIPTION: RS485 Transciever, 200Kbps, SOIC-8 , ALT: TP8485E-SR (3Peak); LIB_STATUS: Prototype; MFN: SN65HVD3082EDR; MFR: TI,3Peak; OUR_STOCK: 10; PART_VALUE: RS485 Driver; PRICE-1: 0.30; SUPPLIER-1: LCSC
J1 = Labops_Lib_AH:1050170001: Check availability <https://pricing.snapeda.com/parts/1050170001/Molex/view-part?ref=eda>; AVAILABILITY: In Stock; CHECK_PRICES: https://www.snapeda.com/parts/1050170001/Molex/view-part/?ref=eda; DESCRIPTION: USB - micro B USB 2.0 Receptacle Connector 5 Position Surface Mount, Right Angle; Through Hole; MF: Molex; MP: 1050170001; PACKAGE: None; PRICE: None; PURCHASE-URL: https://www.snapeda.com/api/url_track_click_mouser/?unipart_id=2755530&manufacturer=Molex&part_name=1050170001&search_term=None; SNAPEDA_LINK: https://www.snapeda.com/parts/1050170001/Molex/view-part/?ref=snap
J2 J4 = Labops_Lib_AH:61300411121: Check availability <https://pricing.snapeda.com/parts/61300411121/W%C3%BCrth%20Elektronik/view-part?ref=eda> Check availability <https://pricing.snapeda.com/parts/61300411121/Wurth%20Electronics/view-part?ref=eda>; DESCRIPTION: Connector Header Through Hole 4 position 0.100 (2.54mm); MFN: 61300411121; MFR: Wurth Electronics
J3 = Labops_Lib_AH:615008148521: WR-MJ Modular Jack Horizontal Plastic 8P8C Tab Up KIND PROPERTIES Quality Class:500 Mating cycles General Information Operating Temperature:-40 up to +85 °C Compliance: RoHS Electrical Properties IR 1:1.5A Working Voltage:120V (AC) Withstanding Voltage:1000V (AC) Contact Resistance:20mΩ RISO:500 MΩ Material Properties Insulator MateriaL:PBT Insulator Flammability Rating:UL94 V-0 Color:Black Contact Material Copper Alloy Contact Plating:Gold Contact Type:Stamped Packaging Properties Packaging:Tray <https://www.we-online.com/catalog/media/o76656v209%20Family_WR-MJ_Plastic_Horizontal_Tab-UP_615008148521.jpg> Details see: https://www.we-online.com/catalog/en/MJ_HORIZONTAL_PLASTIC_8P8C_TAB_UP/ Updated by Yingchun,Shan 2020-01-06 2020 (C) Würth Elektronik; DESCRIPTION: RJ45 unshielded 8P8C; MFN: 615008148521; MFR: Wurth Elektronik; PART_VALUE: 615008148521; TYPE: Horizontal
K1 K2 = Labops_Lib_AH:RYA31012; DESCRIPTION: 5A Relay 12V, SPST NO (1Form A); MFN: RYA31012; MFR: TE Connectivity
Q1 = Labops_Lib_AH:BC817; DESCRIPTION: Transistor BJT NPN SOT23 45V 0.5A; MFN: BC817; MFR: NXP; PRICE-1: 0.03; SUPPLIER-1: Mouser
Q2 Q4 Q6 Q8 = Labops_Lib_AH:UT2955G-AA3-R: PMOSFET, SOT-223, 60V, 1.7A; DESRIPTION: PMOSFET 60V, 1.7A, SOT223; MFN: UT2955G-AA3-R; MFR: UTC; OUR_STOCK: 100; PART_VALUE: UT2955G; PRICE-1: 0.18; SUPPLIER-1: LCSC
Q3 Q5 Q7 Q9 = Labops_Lib_AH:2N7002; DESCRIPTION: NMOSFET, 500mA, 60V, Vth 2.5V; LIB_STATUS: Prototype; MFN: 2N7002; MFR: Diodes, Guangdong Hotetech,NXP; OUR_STOCK: 100; PART_VALUE: NMOSFET; PRICE-1: 0.02; SUPPLIER-1: LCSC
R1-R80 R83-R102 = Labops_Lib_AH:R_0603; MFN: Open Source 0603
R81 R82 = Labops_Lib_AH:RNF12FTD10M0; DESCRIPTION: 10 MOhms ±1% 0.5W, 1/2W Through Hole Resistor Axial Flame Retardant Coating, Safety Metal Film; LIB_STATUS: Prototype; MFN: RNF12FTD10M0; MFR: Stackpole Electronics Inc; OUR-STOCK: 20; PART_VALUE: 10Meg 5%; PRICE-1: 0.29; SUPPLIER-1: Digikey
V1-V4 V8-V10 = Labops_Lib_AH:0603ESDA-24N; DESCRIPTION: aristor 0603 SMD Bidirectional 50V 24V; MFN: 0603ESDA-24N; MFR: Bourns; SUPPLIER-1: LCSC
V5-V7 = Labops_Lib_AH:B72205S0271K101: VARISTOR 205V 800A DISC 5MM; LIB_STATUS: Verified; MFN: B72205S0271K1011; MFR: EPCOS; OUR_STOCK: 10; PART_VALUE: 430V, 400A; PRICE-1: 0.31; SUPPLIER-1: Digikey
X1 X2 = Labops_Lib_AH:B2B-XH-AM(LF)(SN); DESCRIPTION: Connector, 2 pins, Header THT , Pitch 2.5mm, JST, Vertical; MFN: B2B-XH-AM(LF)(SN); MFR: JST; PRICE-1: 0.03; SUPPLIER-1: LCSC; TECHNOLOGY: THT
X3 = Labops_Lib_AH:WF2549-2WS05S0B01; DESCRIPTION: X10, 10 Pins, Header, Pitch 2.54 wire to board 2xrows, THT; MFN: WF2549-2WS05S0B01; MFR: WCON; PRICE-1: 0.25; SUPPLIER-1: LCSC
X4 X6 X23 = Labops_Lib_AH:282834-2; DESCRIPTION: Connector Header Terminal Block 2 Positions, 1 Row, 2.54mm, THT; MFN: 282834-2; MFR: TE; PRICE-1: 0.8; SUPPLIER-1: Digikey
X5 X7 X11-X16 X19-X22 = Labops_Lib_AH:726386-2: Terminals, Faston, GDS-Flachstecker 6.3x0.8mm, TE; CENTROID_NOT_SPECIFIED: No; CONN_GENDER: Male; CONN_ORIENTATION: Straight; CONTACT_MATERIAL: Tin; DATASHEET: http://www.te.com/commerce/DocumentDelivery/DDEController?Action=showdoc&DocId=Customer+Drawing%7F726386%7FG%7Fpdf%7FEnglish%7FENG_CD_726386_G.pdf%7F726386-2; DEVICE_CLASS_L1: Connectors; DEVICE_CLASS_L2: Terminal Blocks | Terminals; DEVICE_CLASS_L3: unset; DIGIKEY_DESCRIPTION: CONN QC TAB 0.250 SOLDER; DIGIKEY_PART_NUMBER: A114371-ND; HEIGHT: 10mm; LEAD_FREE: yes; MF: TE; MFG_PACKAGE_IDENT: 726386-2; MFG_PACKAGE_IDENT_DATE: 0; MFG_PACKAGE_IDENT_REV: 0; MOUSER_DESCRIPTION: Terminals GDS-FLACHSTECK 6.3; MOUSER_PART_NUMBER: 571-726386-2; MPN: 726386-2; PACKAGE: PTH_TERMINAL_8MM0_0MM8; PREFIX: J; ROHS: yes; TEMPERATURE_RANGE_HIGH: +110°C; TEMPERATURE_RANGE_LOW: -30°C; VERIFICATION_VERSION: 0.0.0.1
X8 X9 = Labops_Lib_AH:5-102203-3: 06 MODII HDR SRRA SHRD LF Check availability <https://pricing.snapeda.com/parts/5-102203-3/TE%20Connectivity/view-part?ref=eda>; COMMENT: 5-102203-3; DESCRIPTION: PCB Header, Right Angle, Shrouded, 06 HDR SRRA SHRD LF, AMPMODU Mod II Series | TE Connectivity 5-102203-3; MFN: 5-102203-3; MFR: TE Connectivity; NUMBER_OF_POSITIONS: 6; PACKAGE: None; PRODUCT_TYPE: Connector
X10 = Labops_Lib_AH:MOLEX_206832-0601: Connector Header Through Hole 6 position 0.118" (3.00mm); DESCRIPTION: Connector Header Through Hole 6 position 3mm Microfit; LIB_STATUS: Prototype; MFN: 206832-0601; MFR: Molex; OUR_STOCK: 20; PART_VALUE: 6CCT x 2Row; PRICE-1: 1.32; SUPPLIER-1: Digikey
X17 X18 X24 = Labops_Lib_AH:282834-3; DESCRIPTION: Connector 3 Position THT 1 Row 2.54mm pitch side entry wire to board; MFN: 282834-3; MFR: TE; PRICE-1: 1.7; SUPPLIER-1: Digikey

## Net classes
0 default: clearance 0.152 mm
1 Mains_N: clearance 8 mm to class 0, clearance 0.152 mm
2 Mains_L: clearance 8 mm to class 0, clearance 3.2 mm to class 1, clearance 0.152 mm
3 LV: clearance 0.152 mm to class 0, clearance 8 mm to class 1